# EAGLE design bridge_board_rony (EAGLE 8.0.2)
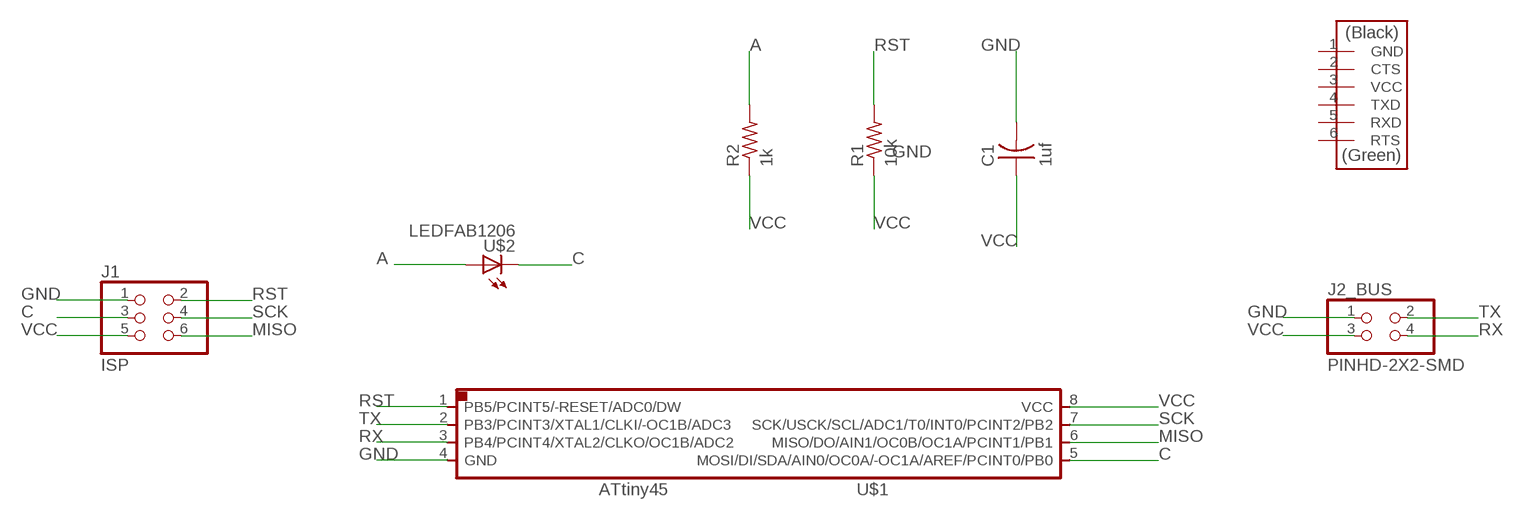
[diagram p0: schematic, sheet 1]

## Parts
C1  1uf  CAP-US1206FAB  [C1206FAB]
J1  ISP  PINHD-2X3-SMD  [2X03SMD]
J2_BUS  PINHD-2X2-SMD  [2X02SMD]
R1  10k  RES-US1206FAB  [R1206FAB]
R2  1k  RES-US1206FAB  [R1206FAB]
U$1  ATTINY45SI  [SOIC8]
U$2  LEDFAB1206  [LED1206FAB]
U$3  FTDI-SMD-HEADER  [1X06SMD]

## Nets
A: R2.2 U$2.1(A)
C: J1.3 U$1.5(MOSI/DI/SDA/AIN0/OC0A/-OC1A/AREF/PCINT0/PB0) U$2.2(C)
GND: C1.2 J1.1 J2_BUS.1 U$1.4(GND)
MISO: J1.6 U$1.6(MISO/DO/AIN1/OC0B/OC1A/PCINT1/PB1)
RST: J1.2 R1.2 U$1.1(PB5/PCINT5/-RESET/ADC0/DW)
RX: J2_BUS.4 U$1.3(PB4/PCINT4/XTAL2/CLKO/OC1B/ADC2)
SCK: J1.4 U$1.7(SCK/USCK/SCL/ADC1/T0/INT0/PCINT2/PB2)
TX: J2_BUS.2 U$1.2(PB3/PCINT3/XTAL1/CLKI/-OC1B/ADC3)
VCC: C1.1 J1.5 J2_BUS.3 R1.1 R2.1 U$1.8(VCC)
Unconnected: U$3.1(GND) U$3.2(CTS) U$3.3(VCC) U$3.4(TXD) U$3.5(RXD) U$3.6(RTS)

## Library data of the parts
C1 = fab:CAP-US
J1 = fab:PINHD-2X3-SMD: PIN HEADER
J2_BUS = fab:PINHD-2X2-SMD
R1 R2 = fab:RES-US: Resistor (US Symbol) Variants with postfix FAB are widened to allow the routing of internal traces
U$1 = fab:ATTINY45
U$2 = fab:LED: LED
U$3 = fab:FTDI-SMD-HEADER

## Net classes
0 default: clearance 0.205 mm

## Board
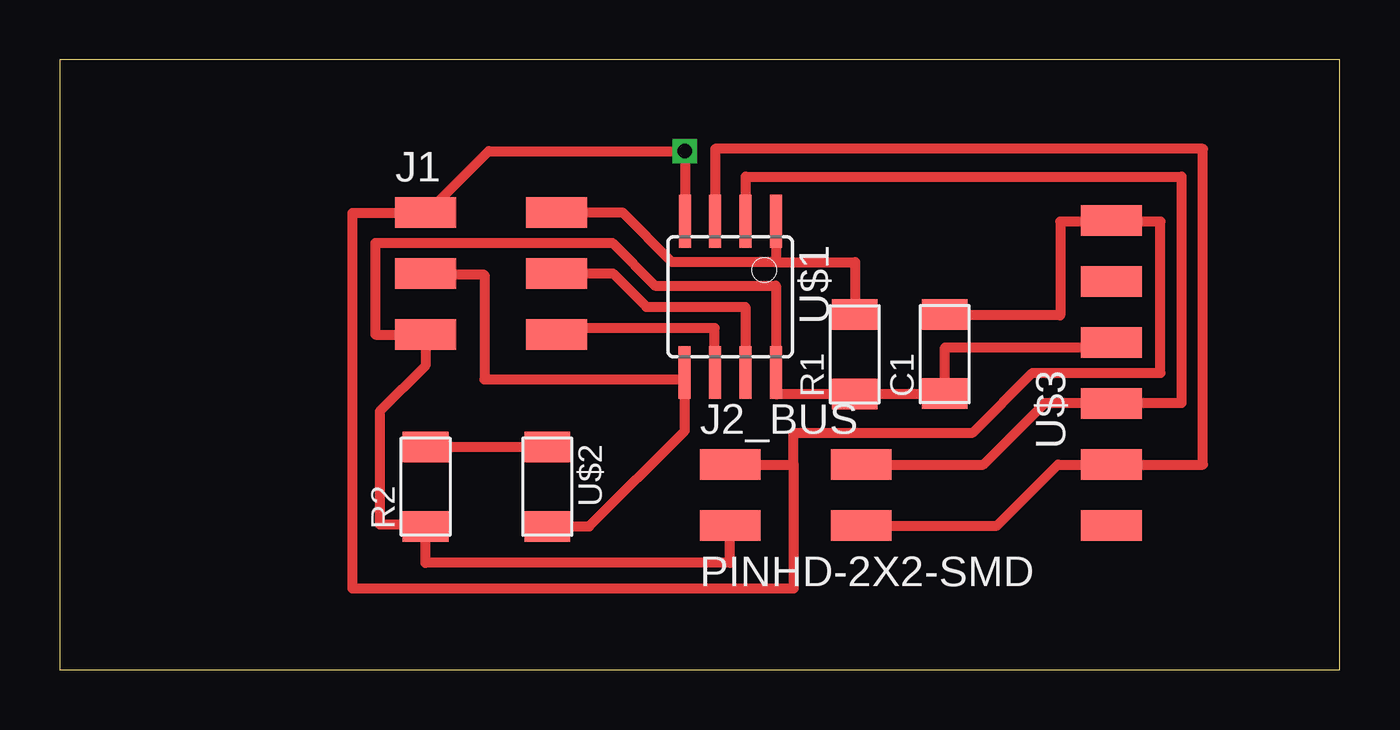
[diagram p1: board, top side]
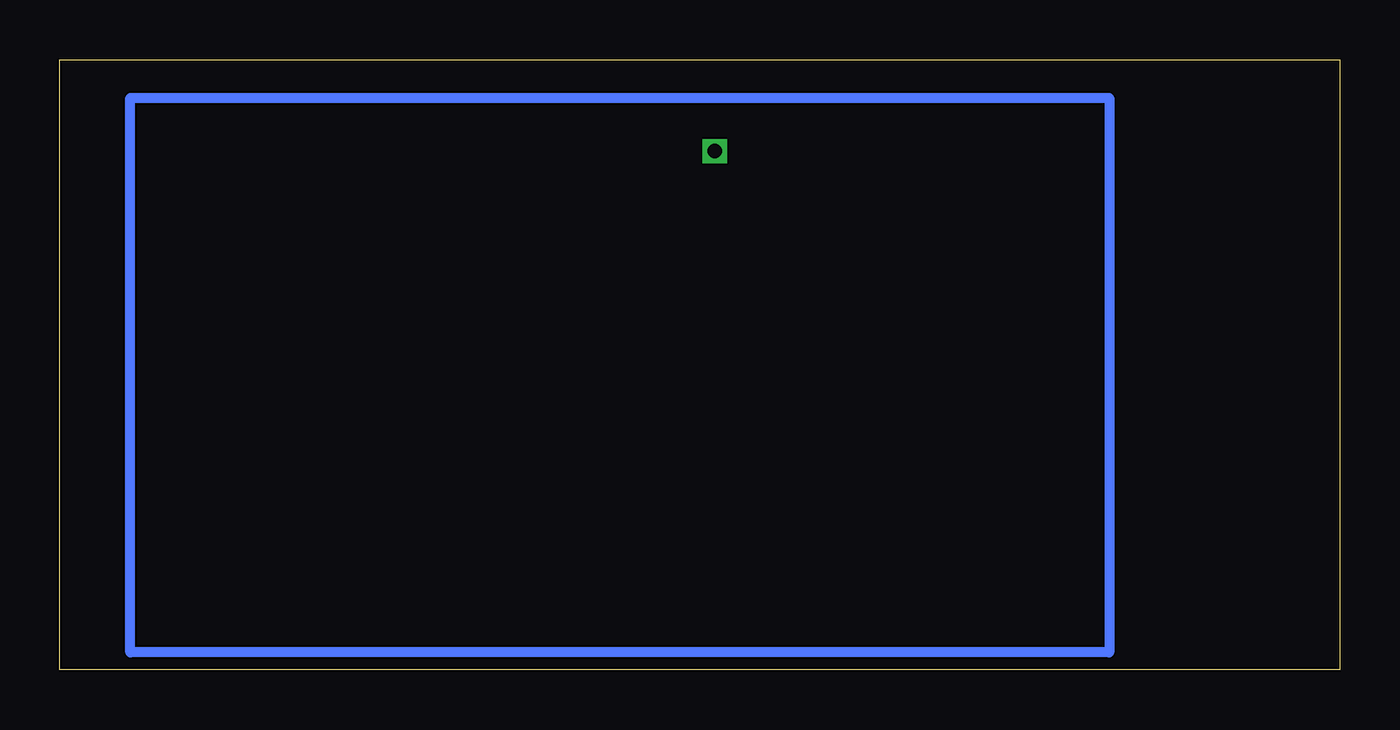
[diagram p2: board, bottom side, seen from below]

Size 53.34 x 25.4 mm. Coordinates in mm from the lower left corner, seen from the top.
Outline: 0,0 53.34,0 53.34,25.4 0,25.4 0,0
Copper layers (1*16): Top 0.035mm / dielectric 1.5mm / cutout 0.035mm
Design rules "default": minimum track width 10mil, minimum drill 24mil, track to track 8mil, track to pad 8mil, pad to pad 8mil, via to via 8mil, smd to smd 8mil, copper to edge 40mil, drill to drill 8mil, minimum pad ring 10mil, minimum via ring 8mil, stop-mask expansion 4mil, vias tented up to drill 0mil, thermal gap 10mil

### Footprints (pad centres in the part's own frame; a part is rotated, then mirrored left to right if it is on the bottom)
C1206FAB = smd 1.27 x 1.905: 1 -1.651,0; 2 1.651,0
2X03SMD = smd 2.54 x 1.27: 1 -2.54,2.54; 2 2.92,2.54; 3 -2.54,0; 4 2.92,0; 5 -2.54,-2.54; 6 2.92,-2.54
2X02SMD = smd 2.54 x 1.27: 1 -2.54,1.27; 2 2.92,1.27; 3 -2.54,-1.27; 4 2.92,-1.27
R1206FAB = smd 1.27 x 1.905: 1 -1.651,0; 2 1.651,0
SOIC8 = smd 0.5 x 2.2: 1 -1.905,-3.154; 2 -0.645,-3.154; 3 0.625,-3.154; 4 1.895,-3.154; 5 1.905,3.154; 6 0.635,3.154; 7 -0.635,3.154; 8 -1.905,3.154
LED1206FAB = smd 1.27 x 1.905: 1 -1.651,0; 2 1.651,0
1X06SMD = smd 2.54 x 1.27: 1 0,6.35; 2 0,3.81; 3 0,1.27; 4 0,-1.27; 5 0,-3.81; 6 0,-6.35

### Placement (x,y rotation side)
C1  36.87,13.15 90 top
J1  17.78,16.51 0 top
J2_BUS  30.48,7.26 0 top
R1  33.13,13.13 90 top
R2  15.24,7.62 90 top
U$1  27.94,15.53 180 top
U$2  20.32,7.62 270 top
U$3  43.83,12.36 0 top

### Tracks (layer width: path | path; a pad name or v marks a point on that pad's centre or on a via)
A
  Top 0.406: U$2.1 R2.2
C
  Top 0.406: 20.32,6.04 U$2.2 22.06,5.97 26.05,9.96 U$1.5 26.04,12.09 17.69,12.09 17.69,16.45 15.3,16.45 J1.3
GND  (via drill 0.6)
  Top 0.406: J2_BUS.1 30.58,8.53 | 30.58,8.53 30.58,9.87 38.05,9.87 40.54,12.36 45.87,12.36 45.87,18.67 41.69,18.67 41.69,14.76 36.88,14.76 C1.2 | 30.58,8.53 30.58,3.38 12.18,3.38 12.18,19.02 15.24,19.02 J1.1 15.32,19.05 17.87,21.6 v26.05,21.6 U$1.4
MISO
  Top 0.406: U$1.6 27.29,14.22 20.7,14.22 J1.6
N$1
  cutout 0.406: 9.6,0.71 50.41,0.71 50.41,23.82 9.6,23.82 9.6,0.71
RST
  Top 0.406: 29.87,19.29 29.87,18.69 U$1.1 29.84,16.98 | 20.7,19.02 J1.2 23.44,19.05 25.51,16.98 29.84,16.98 | R1.2 33.16,14.81 33.16,16.98 29.84,16.98
RX
  Top 0.406: U$1.3 27.32,21.69 47.65,21.69 47.65,8.53 41.6,8.53 39.06,5.99 J2_BUS.4
SCK
  Top 0.406: U$1.7 28.57,15.11 24.45,15.11 23.05,16.51 J1.4
TX
  Top 0.406: 28.54,18.69 U$1.2 28.59,20.54 46.76,20.54 46.76,11.11 41.07,11.11 38.49,8.53 J2_BUS.2
VCC
  Top 0.406: 32.8,11.48 R1.1 33.13,11.49 C1.1 36.89,11.48 36.89,13.42 44.09,13.42 | 15.2,13.97 J1.5 | J1.5 15.24,13.96 13.16,13.96 13.16,17.78 23.02,17.78 24.8,16 29.84,16 U$1.8 29.87,12.38 29.87,11.47 32.8,11.47 32.8,11.48 | 32.8,11.48 32.8,11.49 | J2_BUS.3 27.94,4.45 15.24,4.45 R2.1 15.24,6.04 13.34,6.04 13.34,10.76 15.24,12.66 J1.5